# Altium schematic sheet microphone_DIY.SchDoc
size A4; SheetNumber: 1; SheetTotal: 3
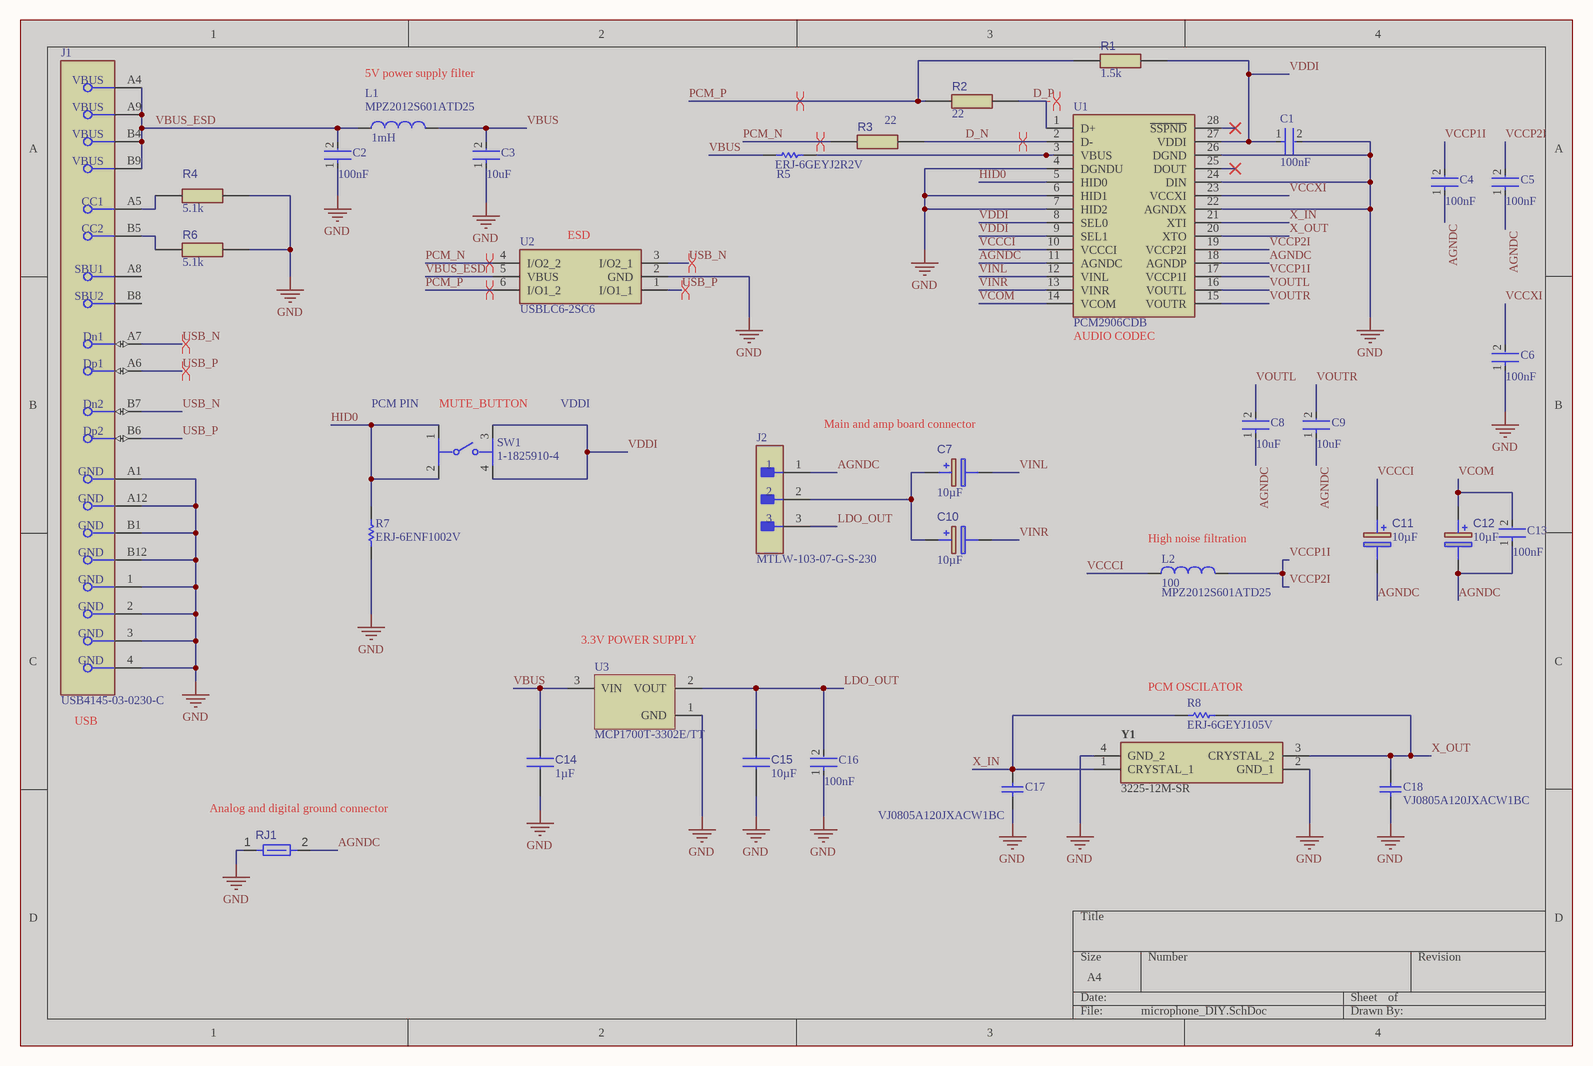
[diagram p0: microphone_DIY.SchDoc]

## Parts
C1  Capacitance: 100nF  [FP-0805B-IPC_C]  (hidden comment: 0805B104K500CT)  (masked out: inside a compile mask, not in the netlist)
C2  Capacitance: 100nF  [FP-0805B-IPC_C]  (hidden comment: 0805B104K500CT)  (masked out: inside a compile mask, not in the netlist)
C3  Capacitance: 10uF  [FP-0805B-IPC_C]  (hidden comment: 0805B104K500CT)  (masked out: inside a compile mask, not in the netlist)
C4  Capacitance: 100nF  [FP-0805B-IPC_C]  (hidden comment: 0805B104K500CT)  (masked out: inside a compile mask, not in the netlist)
C5  Capacitance: 100nF  [FP-0805B-IPC_C]  (hidden comment: 0805B104K500CT)  (masked out: inside a compile mask, not in the netlist)
C6  Capacitance: 100nF  [FP-0805B-IPC_C]  (hidden comment: 0805B104K500CT)  (masked out: inside a compile mask, not in the netlist)
C7  value 10µF  [593D106X9016B2TE3-Footprint-1]  (hidden comment: 593D106X9016B2TE3)  (masked out: inside a compile mask, not in the netlist)
C8  Capacitance: 10uF  [FP-0805B-IPC_C]  (hidden comment: 0805B104K500CT)  (masked out: inside a compile mask, not in the netlist)
C9  Capacitance: 10uF  [FP-0805B-IPC_C]  (hidden comment: 0805B104K500CT)  (masked out: inside a compile mask, not in the netlist)
C10  value 10µF  [593D106X9016B2TE3-Footprint-1]  (hidden comment: 593D106X9016B2TE3)  (masked out: inside a compile mask, not in the netlist)
C11  value 10µF  [593D106X9016B2TE3-Footprint-1]  (hidden comment: 593D106X9016B2TE3)  (masked out: inside a compile mask, not in the netlist)
C12  value 10µF  [593D106X9016B2TE3-Footprint-1]  (hidden comment: 593D106X9016B2TE3)  (masked out: inside a compile mask, not in the netlist)
C13  Capacitance: 100nF  [FP-0805B-IPC_C]  (hidden comment: 0805B104K500CT)  (masked out: inside a compile mask, not in the netlist)
C14  value 1µF  [08055C105KAT2A-Footprint-1]  (hidden comment: 08055C105KAT2A)  (masked out: inside a compile mask, not in the netlist)
C15  value 10µF  [0805B106K100CT-Footprint-1]  (hidden comment: 0805B106K100CT)  (masked out: inside a compile mask, not in the netlist)
C16  Capacitance: 100nF  [FP-0805B-IPC_C]  (hidden comment: 0805B104K500CT)  (masked out: inside a compile mask, not in the netlist)
C17  VJ0805A120JXACW1BC  [CAPC2013X135X50NL15T20]  (masked out: inside a compile mask, not in the netlist)
C18  VJ0805A120JXACW1BC  [CAPC2013X135X50NL15T20]  (masked out: inside a compile mask, not in the netlist)
J1  USB4145-03-0230-C  [FP-USB4145-03-0230-C-MFG]  (masked out: inside a compile mask, not in the netlist)
J2  MTLW-103-07-G-S-230  [FP-MTLW-103-07-G-S-230-MFG]  (masked out: inside a compile mask, not in the netlist)
L1  MPZ2012S601ATD25  value 1mH  [MPZ2012S601ATD25-Footprint-1]  (masked out: inside a compile mask, not in the netlist)
L2  MPZ2012S601ATD25  value 100  [MPZ2012S601ATD25-Footprint-1]  (masked out: inside a compile mask, not in the netlist)
R1  value 1.5k  [AR05BTCW1501-Footprint-1]  (hidden comment: AR05BTCW1501)  (masked out: inside a compile mask, not in the netlist)
R2  value 22  [2-1614884-5-Footprint-1]  (hidden comment: CPF0805B22RE1)  (masked out: inside a compile mask, not in the netlist)
R3  value 22  [2-1614884-5-Footprint-1]  (hidden comment: CPF0805B22RE1)  (masked out: inside a compile mask, not in the netlist)
R4  value 5.1k  [ERJP06F5101V-Footprint-1]  (hidden comment: ERJP06F5101V)  (masked out: inside a compile mask, not in the netlist)
R5  ERJ-6GEYJ2R2V  [RESC2013X70X40ML20T20]  (masked out: inside a compile mask, not in the netlist)
R6  value 5.1k  [ERJP06F5101V-Footprint-1]  (hidden comment: ERJP06F5101V)  (masked out: inside a compile mask, not in the netlist)
R7  ERJ-6ENF1002V  [RESC2013X70X40ML20T20]  (masked out: inside a compile mask, not in the netlist)
R8  ERJ-6GEYJ105V  [RESC2013X70X40NL20T20]  (masked out: inside a compile mask, not in the netlist)
RJ1  Net Tie 12x8mil  [SHORT06-FP]  (value not drawn)  (net tie, no BOM)  (masked out: inside a compile mask, not in the netlist)
SW1  1-1825910-4  [FP-1-1825910-4-MFG]  (masked out: inside a compile mask, not in the netlist)
U1  PCM2906CDB  [PCM2906CDB-Footprint-1]  (masked out: inside a compile mask, not in the netlist)
U2  USBLC6-2SC6  [STM-SOT23-6L_V]  (masked out: inside a compile mask, not in the netlist)
U3  MCP1700T-3302E/TT  [SOT-23-TT3_N]  (masked out: inside a compile mask, not in the netlist)
Y1  3225-12M-SR  [3225-12M-SR-Footprint-1]  (masked out: inside a compile mask, not in the netlist)

## Layout directives
differential pair: (no net found under the mark)

## Notes on the sheet
- 5V power supply filter
- (near U2) ESD
- (near U1) AUDIO CODEC
- (near SW1) PCM PIN
- (near SW1) MUTE_BUTTON
- VDDI
- Main and amp board connector
- (near L2) High noise filtration
- (near U3) 3.3V POWER SUPPLY
- (near J1) USB
- (near R8) PCM OSCILATOR
- (near RJ1) Analog and digital ground connector

## Library data of the parts
C1-C6 C8 C9 C13 C16 = CMP-45632-000003-1: CAP CER 0.1UF 50V X7R 0805; Tolerance: 10%; RoHS Compliant: Yes; Packaging: Tape and Reel; Voltage Rating (DC): 50V; Voltage Rating: 50V; Length: 2mm; Lead Free: Lead Free; Voltage: 50V; Case/Package: 0805; Case Code (Metric): 2012; Depth: 1.25mm; Min Operating Temperature: -55°C; Case Code (Imperial): 0805; Max Operating Temperature: 125°C; Radiation Hardening: No; Dielectric: X7R
C7 C10-C12 = CMP-001-00089-1: Cap Tant Solid 10uF 16V B CASE 10% (3.5 X 2.8 X 1.9mm) Inward L SMD 3528-21 0.8 Ohm 125C T/R; Ripple Current: 132mA; Pins: 2; Case/Package: 1411; Voltage Rating: 16V; Min Operating Temperature: -55°C; Max Operating Temperature: 125°C; Tolerance: 10%; Mounting Technology: Surface Mount
C14 = CMP-001-00087-1: 0805 Standard 1UF Ceramic Multilayer Capacitor, 50V, +125C, X7R Dielectric, +/-10%; Tolerance: 10%; Mounting Technology: Surface Mount; Min Operating Temperature: -55°C; Case/Package: 0805; Max Operating Temperature: 125°C; Voltage Rating: 50V
C15 = CMP-001-00088-1: 10V 10uF X7R ±10% 0805 Multilayer Ceramic Capacitors MLCC - SMD/SMT ROHS; Mounting Technology: Surface Mount; Max Operating Temperature: 125°C; Case/Package: 0805; Min Operating Temperature: -55°C
C17 C18 = CMP-2007-03409-1: Manufacturer: Vitramon; Part Number: VJ0805A120JXACW1BC
J1 = CMP-03329-129995627-1: USB4145-03-0230-C USB Connectors USB-C Rec 3u Vert 16P SMT 2.3mm TH stakes H7.46mm T+R+Cap; Number of Contacts: 16; USB Standard: USB 2.0; Voltage Rating: 48V; Current Rating: 6.25A; Min Operating Temperature: -25°C; Contact Material: Gold, Nickel; Height: 7.66mm; NexarPartId: 129995627; Max Operating Temperature: 85°C
J2 = CMP-02766-001679-1: CONN HEADER VERT 3POS 2.54MM; Max Current Rating: 3A; Number of Contacts: 3; Gender: Male; Contact Material: Bronze; Pitch: 2.54mm; Housing Material: Polymer; Contact Plating: Gold; Radiation Hardening: No; Depth: 2.48mm; Packaging: Bulk; Number of Rows: 1; Max Operating Temperature: 125°C; Housing Color: Black; Termination: Solder; Min Operating Temperature: -55°C; Length: 7.62mm; RoHS Compliant: Yes; Orientation: Straight
L1 L2 = CMP-006-00021-1: Ferrite Beads Multi-Layer Power 600Ohm 25% 100MHz 2A 0.1Ohm DCR 0805 Automotive T/R; Min Operating Temperature: -55°C; Case/Package: 0805; Current Rating: 2A; Max Current Rating: 2A; Max Operating Temperature: 125°C; Mounting Technology: Surface Mount; Tolerance: 25%
R1 = CMP-009-00182-1: 125mW Thin Film Resistor 100V ±25ppm/℃ ±0.1% 1.5kΩ 0805 Chip Resistor - Surface Mount ROHS; Mounting Technology: Surface Mount; Min Operating Temperature: -55°C; Tolerance: 0.1%; Max Operating Temperature: 155°C; Case/Package: 0805
R2 R3 = CMP-009-00180-1: Res Thin Film 0805 22 Ohm 0.1% 0.1W(1/10W) ±25ppm/°C Pad SMD T/R Medical; Voltage Rating: 100V; Pins: 2; Mounting Technology: Surface Mount; Max Operating Temperature: 155°C; Case/Package: 0805; Min Operating Temperature: -55°C; Tolerance: 0.1%
R4 R6 = CMP-009-00183-1: Res Thick Film 0805 5.1K Ohm 1% 0.25W ±100ppm/°C Molded SMD Punched Carrier T/R; Voltage Rating: 400V; Pins: 2; Tolerance: 1%; Case/Package: 0805; Mounting Technology: Surface Mount; Max Operating Temperature: 155°C; Min Operating Temperature: -55°C
R5 = CMP-2001-00391-1: Manufacturer: Panasonic; Part Number: ERJ-6GEYJ2R2V
R7 = CMP-2001-04376-1: Manufacturer: Panasonic; Part Number: ERJ-6ENF1002V
R8 = CMP-2001-00339-1: Manufacturer: Panasonic; Part Number: ERJ-6GEYJ105V
RJ1 = CMP-009-00121-2: Max Operating Temperature: 155°C; Pins: 2; Min Operating Temperature: -55°C
SW1 = CMP-03407-000002-1: SWITCH TACTILE SPST-NO 0.05A 24V; Manufacturer: TE Connectivity; Operating Force: 160gf; Contact Current Rating: 50mA; Electromechanical Life: 100000Cycles; Contact Resistance: 100mΩ; Octopart: https://octopart.com/1-1825910-4-te+connectivity-42270468; ComponentLink2URL: https://www.te.com/commerce/DocumentDelivery/DDEController?Action=showdoc&DocId=Customer+Drawing%7F1825910%7FC10%7Fpdf%7FEnglish%7FENG_CD_1825910_C10.pdf%7F1-1825910-4; Throw Configuration: SPST-NO; Height: 9.8mm; Package: 1-1825910-4; Automotive: No; Device Class L2: Switches; Voltage Rating Dc: 24V; Temperature Range High: +85°C; Device Class L3: Tactile Switches; Mouser Description: Tactile Switches 6MM ACTHIGH TEMP TACT SWITCH; Manufacturer Part Number: 1-1825910-4; Lead Free: Yes; Temperature Range Low: -35°C; Digikey Description: SWITCH TACTILE SPST-NO 0.05A 24V; Device Class L1: Electromechanical; Mount: Through Hole; RoHS: TRUE; ComponentLink2Description: Datasheet; Temperature: -35°C to +85°C; Category: Switch
U1 = CMP-00024-00006-1: Stereo USB CODEC with line out and S/PDIF, Bus-powered 28-SSOP -25 to 85; Min Operating Temperature: -25°C; Max Operating Temperature: 85°C; Pins: 28; Mounting Technology: Surface Mount; Case/Package: SSOP
U2 = CMP-00000-1: 5A 17V 6V Unidirectional 5.25V SOT-23-6 ESD and Surge Protection (TVS/ESD) ROHS; Working Voltage: 5V; Peak Reverse Current: 150nA; Operating Supply Voltage: 1.1V; Element Configuration: Dual; Test Current: 1mA; Number of Bidirectional Channels: 2; Value: 2.5pF; Max Junction Temperature (Tj): 125°C; ESD Protection: Yes; Number of Elements: 1; Data Rate: 480Mbps; Breakdown Voltage: 6V; Height: 1.45mm; Length: 3.05mm; Reverse Standoff Voltage: 5V; Termination: SMD/SMT; Clamping Voltage: 17V; Leakage Current: 150nA; Width: 1.75mm; Reverse Breakdown Voltage: 6V; Min Operating Temperature: -40°C; Contact Plating: Tin; Max Reverse Leakage Current: 150nA; Lifecycle Status: Production; Forward Voltage: 1.1V; Min Breakdown Voltage: 6V; Polarity: Unidirectional; Max Operating Temperature: 125°C; Schedule B: 8536300000, 8536300000; Max Repetitive Reverse Voltage (Vrrm): 5.25V; Max Breakdown Voltage: 6V; RoHS: Compliant; China RoHS: Compliant; Direction: Unidirectional; REACH SVHC: Yes; Radiation Hardening: No; Pins: 6; Mounting Technology: Surface Mount; Lead Free: Lead Free; Number of Channels: 2; Power Line Protection: Yes; Number of Terminals: 6; Case/Package: SOT-23; Peak Pulse Current: 5A; Depth: 1.75mm
U3 = CMP-0136-00791-1: Low Quiescent Current LDO, 3-Pin SOT-23, Extended Temperature, Tape and Reel; PackageVersion: revBB, Aug-2009; Code_IPC: SOT23-3; PackageReference: SOT-23-TT3; DatasheetVersion: revB, Feb-2007; PackageDescription: 3-Lead Plastic Small Outline Transistor (TT) [SOT-23]
Y1 = CMP-003-00030-1: SMD crystal oscilator 12 MHz; Frequency: 12MHz; Mounting Technology: SMD